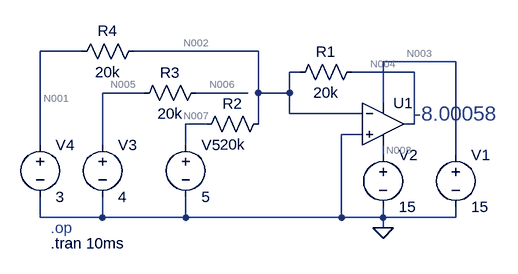
[diagram p0: schematic SummingAmp.asc]
SummingAmp.asc, the LTspice schematic file:
Version 4
SHEET 1 880 680
WIRE -288 112 -352 112
WIRE -16 112 -208 112
WIRE 288 128 176 128
WIRE 48 144 32 144
WIRE 224 144 128 144
WIRE -192 176 -256 176
WIRE -32 176 -112 176
WIRE -16 176 -16 112
WIRE 32 176 32 144
WIRE 32 176 -16 176
WIRE 176 192 176 128
WIRE 32 208 32 176
WIRE 144 208 32 208
WIRE -96 224 -128 224
WIRE -16 224 -16 176
WIRE 224 224 224 144
WIRE 224 224 208 224
WIRE 144 240 112 240
WIRE -352 256 -352 112
WIRE -256 256 -256 176
WIRE -128 256 -128 224
WIRE 176 272 176 256
WIRE 288 272 288 128
WIRE -352 368 -352 336
WIRE -256 368 -256 336
WIRE -256 368 -352 368
WIRE -128 368 -128 336
WIRE -128 368 -256 368
WIRE 112 368 112 240
WIRE 112 368 -128 368
WIRE 176 368 176 352
WIRE 176 368 112 368
WIRE 288 368 288 352
WIRE 288 368 176 368
WIRE 176 384 176 368
FLAG 176 384 0
SYMBOL voltage 288 256 R0
SYMATTR InstName V1
SYMATTR Value 15
SYMBOL voltage 176 256 R0
SYMATTR InstName V2
SYMATTR Value 15
SYMBOL voltage -256 240 R0
SYMATTR InstName V3
SYMATTR Value 4
SYMBOL voltage -352 240 R0
SYMATTR InstName V4
SYMATTR Value 3
SYMBOL voltage -128 240 R0
SYMATTR InstName V5
SYMATTR Value 5
SYMBOL res 144 128 R90
WINDOW 0 0 56 VBottom 2
WINDOW 3 32 56 VTop 2
SYMATTR InstName R1
SYMATTR Value 20k
SYMBOL res 0 208 R90
WINDOW 0 0 56 VBottom 2
WINDOW 3 32 56 VTop 2
SYMATTR InstName R2
SYMATTR Value 20k
SYMBOL res -96 160 R90
WINDOW 0 0 56 VBottom 2
WINDOW 3 32 56 VTop 2
SYMATTR InstName R3
SYMATTR Value 20k
SYMBOL res -192 96 R90
WINDOW 0 0 56 VBottom 2
WINDOW 3 32 56 VTop 2
SYMATTR InstName R4
SYMATTR Value 20k
SYMBOL OpAmps\\UniversalOpAmp 176 224 R0
SYMATTR InstName U1
TEXT -336 384 Left 2 ;.op
TEXT 224 208 Left 3 ;-8.00058
TEXT -336 408 Left 2 !.tran 10ms

The netlist it stands for:
* SummingAmp.asc
V1 N003 0 15
V2 N008 0 15
V3 N005 0 4
V4 N001 0 3
V5 N007 0 5
R1 N004 N002 20k
R2 N002 N007 20k
R3 N006 N005 20k
R4 N002 N001 20k
XU1 0 N002 N003 N008 N004 level1 Avol=1Meg GBW=10Meg Vos=0 En=0 Enk=0 In=0 Ink=0 Rin=500Meg  ; pins In+ In- V+ V- OUT
* .op
* -8.00058
.tran 10ms
.lib UniversalOpAmp1.lib
.backanno
.end

* Results of the author's LTspice run, read from the files saved beside the schematic
* Operating Point, zero values left out:
*   V(n003) = 15 V
*   V(n008) = 15 V
*   V(n005) = 4 V
*   V(n001) = 3 V
*   V(n007) = 5 V
*   V(n004) = -8.001 V
*   V(n002) = 8.001 µV
*   V(n006) = 4 V
*   I(R1) = -400 µA
*   I(R2) = -250 µA
*   I(R4) = -150 µA
*   I(V1) = -30 nA
*   I(V2) = -30 nA
*   I(V4) = -150 µA
*   I(V5) = -250 µA
*   Ix(u1:1) = -30 nA
*   Ix(u1:2) = -30 nA
*   Ix(u1:3) = 30 nA
*   Ix(u1:4) = 30 nA
*   Ix(u1:5) = 400 µA